# EAGLE design esquema (EAGLE 9.4.2)
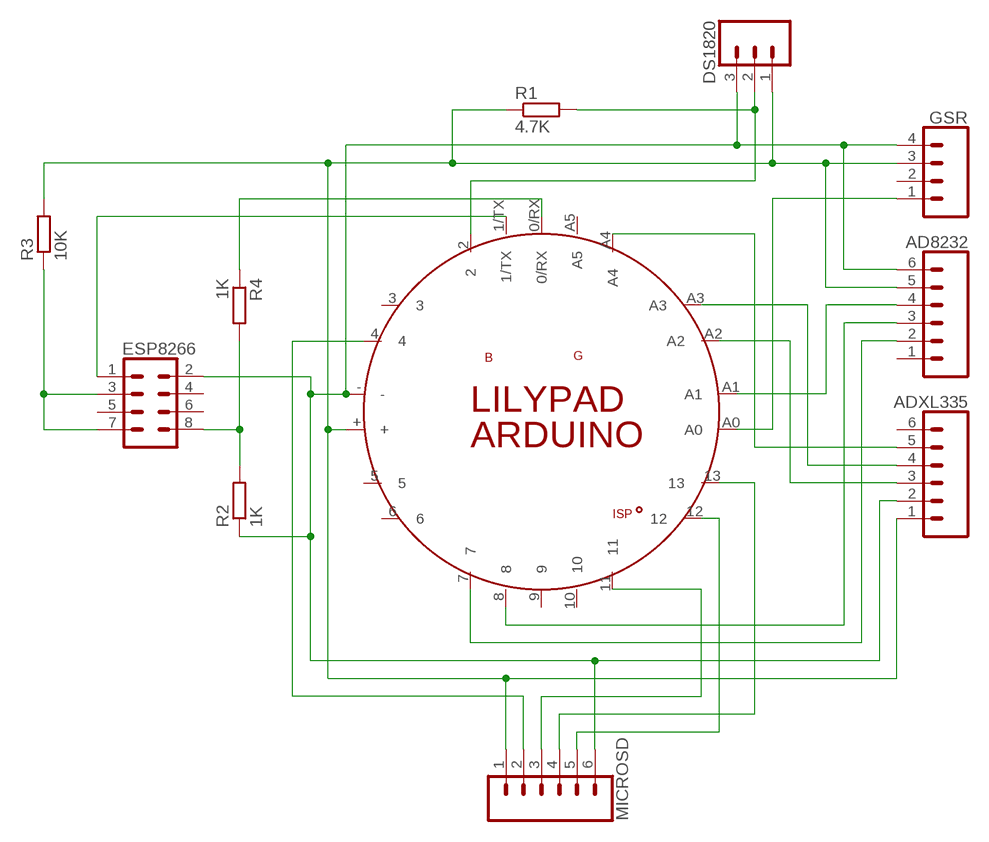
[diagram p0: schematic, sheet 1]

## Parts
AD8232  CONN_06FEMALE_LOCK  [1X06_FEMALE_LOCK.010]
ADXL335  CONN_06FEMALE_LOCK  [1X06_FEMALE_LOCK.010]
DS1820  CONN_03  [1X03]
ESP8266  CONN_04X2  [2X4]
GSR  CONN_04JST-PTH  [JST-4-PTH]
MICROSD  CONN_06FEMALE_LOCK  [1X06_FEMALE_LOCK.010]
PCB1  ARDUINO_LILYPAD  [ARDUINO_LILYPAD]
R1  4.7K  R-EU_0309/12  [0309/12]
R2  1K  R-EU_0309/12  [0309/12]
R3  10K  R-EU_0309/12  [0309/12]
R4  1K  R-EU_0309/12  [0309/12]

## Nets
N$1: MICROSD.3 PCB1.11
N$2: MICROSD.2 PCB1.4
N$3: GSR.1 PCB1.A0
N$4: AD8232.4 PCB1.A1
N$5: AD8232.3 PCB1.8
N$6: AD8232.2 PCB1.7
N$7: DS1820.2 PCB1.2 R1.2
N$8: ADXL335.3 PCB1.A2
N$9: ADXL335.4 PCB1.A3
N$10: ESP8266.3 ESP8266.7 R3.1
N$11: ADXL335.5 PCB1.A4
N$12: ESP8266.1 PCB1.1/TX
N$13: ESP8266.8 R2.2 R4.2
N$14: PCB1.0/RX R4.1
N$15: AD8232.5 ADXL335.1 DS1820.1 GSR.3 MICROSD.1 PCB1.+ R1.1 R3.2
N$16: AD8232.6 ADXL335.2 DS1820.3 ESP8266.2 GSR.4 MICROSD.6 PCB1.- R2.1
N$17: MICROSD.4 PCB1.13
N$18: MICROSD.5 PCB1.12
Unconnected: AD8232.1 ADXL335.6 ESP8266.4 ESP8266.5 ESP8266.6 GSR.2 PCB1.3 PCB1.5 PCB1.5V.(VCC) PCB1.6 PCB1.9 PCB1.10 PCB1.A5 PCB1.DTR PCB1.GND. PCB1.GND.. PCB1.GND_(GND) PCB1.MISO PCB1.MOSI PCB1.RESET..(RST) PCB1.RXI PCB1.SCK PCB1.TXO PCB1.VCC.

## Library data of the parts
AD8232 ADXL335 MICROSD = SparkFun-Connectors:CONN_06: Multi connection point. Often used as Generic Header-pin footprint for 0.1 inch spaced/style header connections On any of the 0.1 inch spaced packages, you can populate with these: Break Away Headers - Straight <https://www.sparkfun.com/products/116> (PRT-00116) Break Away Male Headers - Right Angle <https://www.sparkfun.com/products/553> (PRT-00553) Female Headers <https://www.sparkfun.com/products/115> (PRT-00115) Break Away Headers - Machine Pin <https://www.sparkfun.com/products/117> (PRT-00117) Break Away Female Headers - Swiss Machine Pin <https://www.sparkfun.com/products/743> (PRT-00743) Arduino Stackable Header - 6 Pin <https://www.sparkfun.com/products/9280> (PRT-09280) For SCREWTERMINALS and SPRING TERMINALS visit here: Screw Terimnals on SparkFun.com <https://www.sparkfun.com/search/results?term=Screw+Terminals> (5mm/3.5mm/2.54mm spacing) This device is also useful as a general connection point to wire up your design to another part of your project. Our various solder wires solder well into these plated through hole pads. Hook-Up Wire - Assortment (Stranded, 22 AWG) <https://www.sparkfun.com/products/11375> (PRT-11375) Hook-Up Wire - Assortment (Solid Core, 22 AWG) <https://www.sparkfun.com/products/11367> (PRT-11367) View the entire wire category on our website here <https://www.sparkfun.com/categories/141>
DS1820 = SparkFun-Connectors:CONN_03: Multi connection point. Often used as Generic Header-pin footprint for 0.1 inch spaced/style header connections On any of the 0.1 inch spaced packages, you can populate with these: Break Away Headers - Straight <https://www.sparkfun.com/products/116> (PRT-00116) Break Away Male Headers - Right Angle <https://www.sparkfun.com/products/553> (PRT-00553) Female Headers <https://www.sparkfun.com/products/115> (PRT-00115) Break Away Headers - Machine Pin <https://www.sparkfun.com/products/117> (PRT-00117) Break Away Female Headers - Swiss Machine Pin <https://www.sparkfun.com/products/743> (PRT-00743) Stackable Header - 3 Pin (Female, 0.1") <https://www.sparkfun.com/products/13875> (PRT-13875) For SCREWTERMINALS and SPRING TERMINALS visit here: Screw Terimnals on SparkFun.com <https://www.sparkfun.com/search/results?term=Screw+Terminals> (5mm/3.5mm/2.54mm spacing) This device is also useful as a general connection point to wire up your design to another part of your project. Our various solder wires solder well into these plated through hole pads. Hook-Up Wire - Assortment (Stranded, 22 AWG) <https://www.sparkfun.com/products/11375> (PRT-11375) Hook-Up Wire - Assortment (Solid Core, 22 AWG) <https://www.sparkfun.com/products/11367> (PRT-11367) View the entire wire category on our website here <https://www.sparkfun.com/categories/141> Special notes: Molex polarized connector foot print use with SKU : PRT-08232 with associated crimp pins and housings.; PROD_ID: XXX-00000; VALUE: 455-1750-1-ND
ESP8266 = SparkFun-Connectors:CONN_04X2: Multi connection point. Often used as Generic Header-pin footprint for 0.1 inch spaced/style header connections On any of the 0.1 inch spaced packages, you can populate with these: Break Away Headers - Straight <https://www.sparkfun.com/products/116> (PRT-00116) Break Away Male Headers - Right Angle <https://www.sparkfun.com/products/553> (PRT-00553) Female Headers <https://www.sparkfun.com/products/115> (PRT-00115) Break Away Headers - Machine Pin <https://www.sparkfun.com/products/117> (PRT-00117) Break Away Female Headers - Swiss Machine Pin <https://www.sparkfun.com/products/743> (PRT-00743)
GSR = SparkFun-Connectors:CONN_04: Multi connection point. Often used as Generic Header-pin footprint for 0.1 inch spaced/style header connections On any of the 0.1 inch spaced packages, you can populate with these: Break Away Headers - Straight <https://www.sparkfun.com/products/116> (PRT-00116) Break Away Male Headers - Right Angle <https://www.sparkfun.com/products/553> (PRT-00553) Female Headers <https://www.sparkfun.com/products/115> (PRT-00115) Break Away Headers - Machine Pin <https://www.sparkfun.com/products/117> (PRT-00117) Break Away Female Headers - Swiss Machine Pin <https://www.sparkfun.com/products/743> (PRT-00743) For SCREWTERMINALS and SPRING TERMINALS visit here: Screw Terimnals on SparkFun.com <https://www.sparkfun.com/search/results?term=Screw+Terminals> (5mm/3.5mm/2.54mm spacing) This device is also useful as a general connection point to wire up your design to another part of your project. Our various solder wires solder well into these plated through hole pads. Hook-Up Wire - Assortment (Stranded, 22 AWG) <https://www.sparkfun.com/products/11375> (PRT-11375) Hook-Up Wire - Assortment (Solid Core, 22 AWG) <https://www.sparkfun.com/products/11367> (PRT-11367) View the entire wire category on our website here <https://www.sparkfun.com/categories/141> Special notes: Molex polarized connector foot print use with SKU : PRT-08231 with associated crimp pins and housings. 1MM SMD Version SKU: PRT-10208; PROD_ID: WIRE-13531; SF_ID: PRT-09916
PCB1 = E14_Arduino_revB:ARDUINO_LILYPAD: Device for representing a Lilypad Arduino board with a footprint in an EAGLE design. Created by Dave Young for Element14. More EAGLE documentation at: http://www.element14.com/community/community/knode/cadsoft_eagle
R1-R4 = rcl:R-EU_: RESISTOR, European symbol; SPICEPREFIX: R

## Board
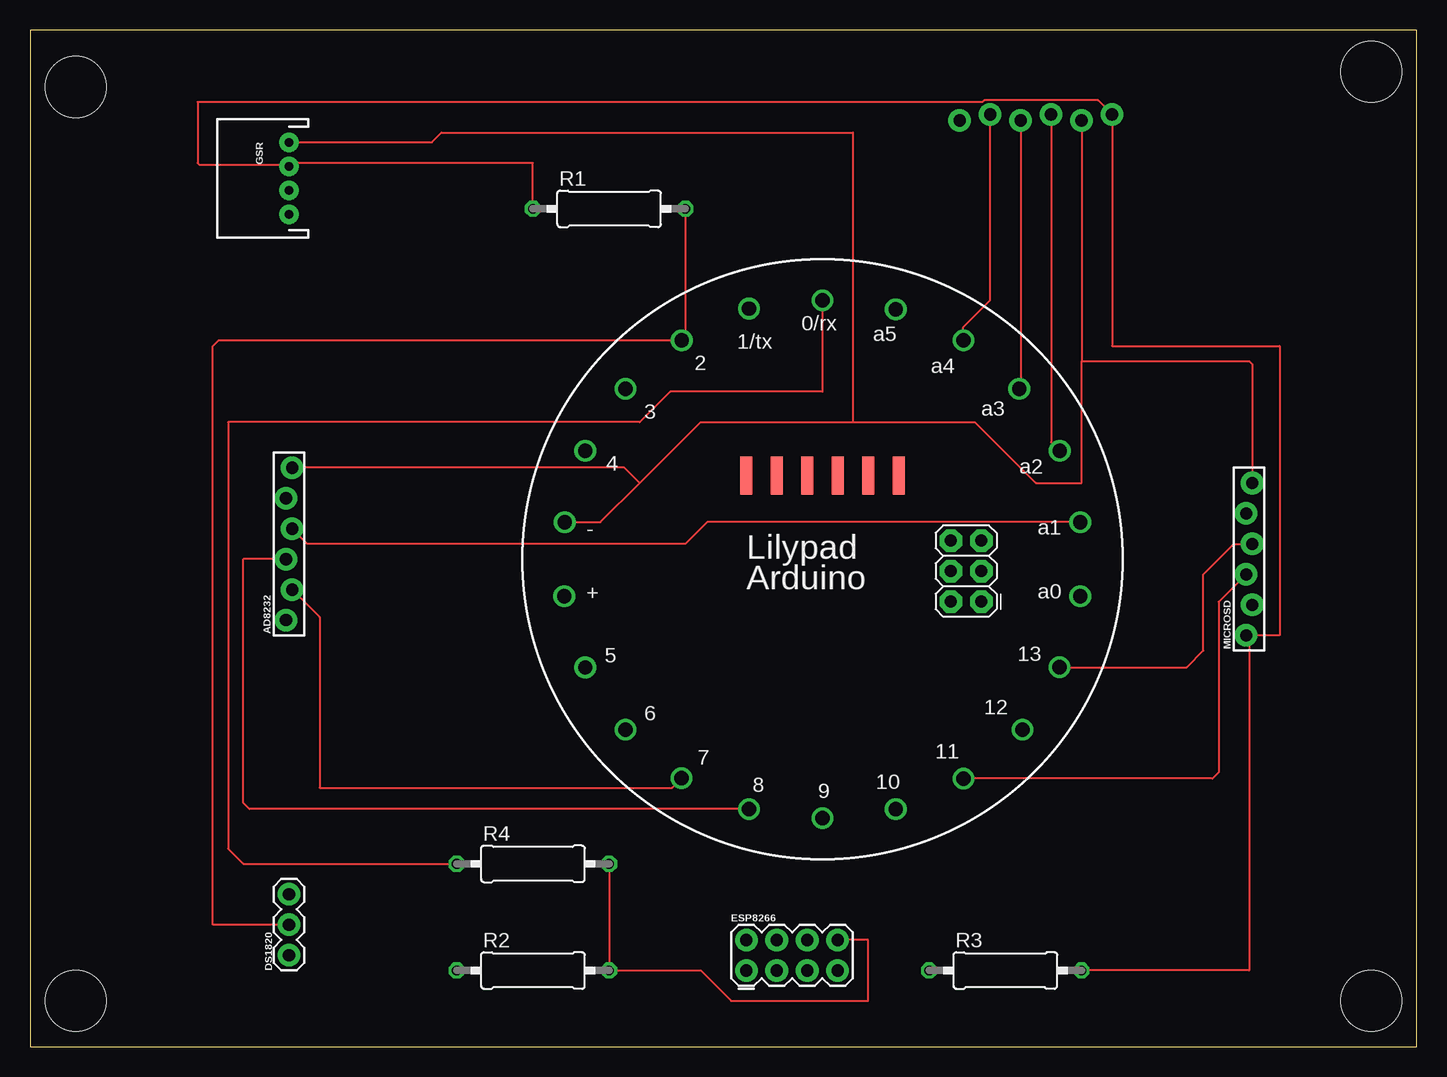
[diagram p1: board, top side]
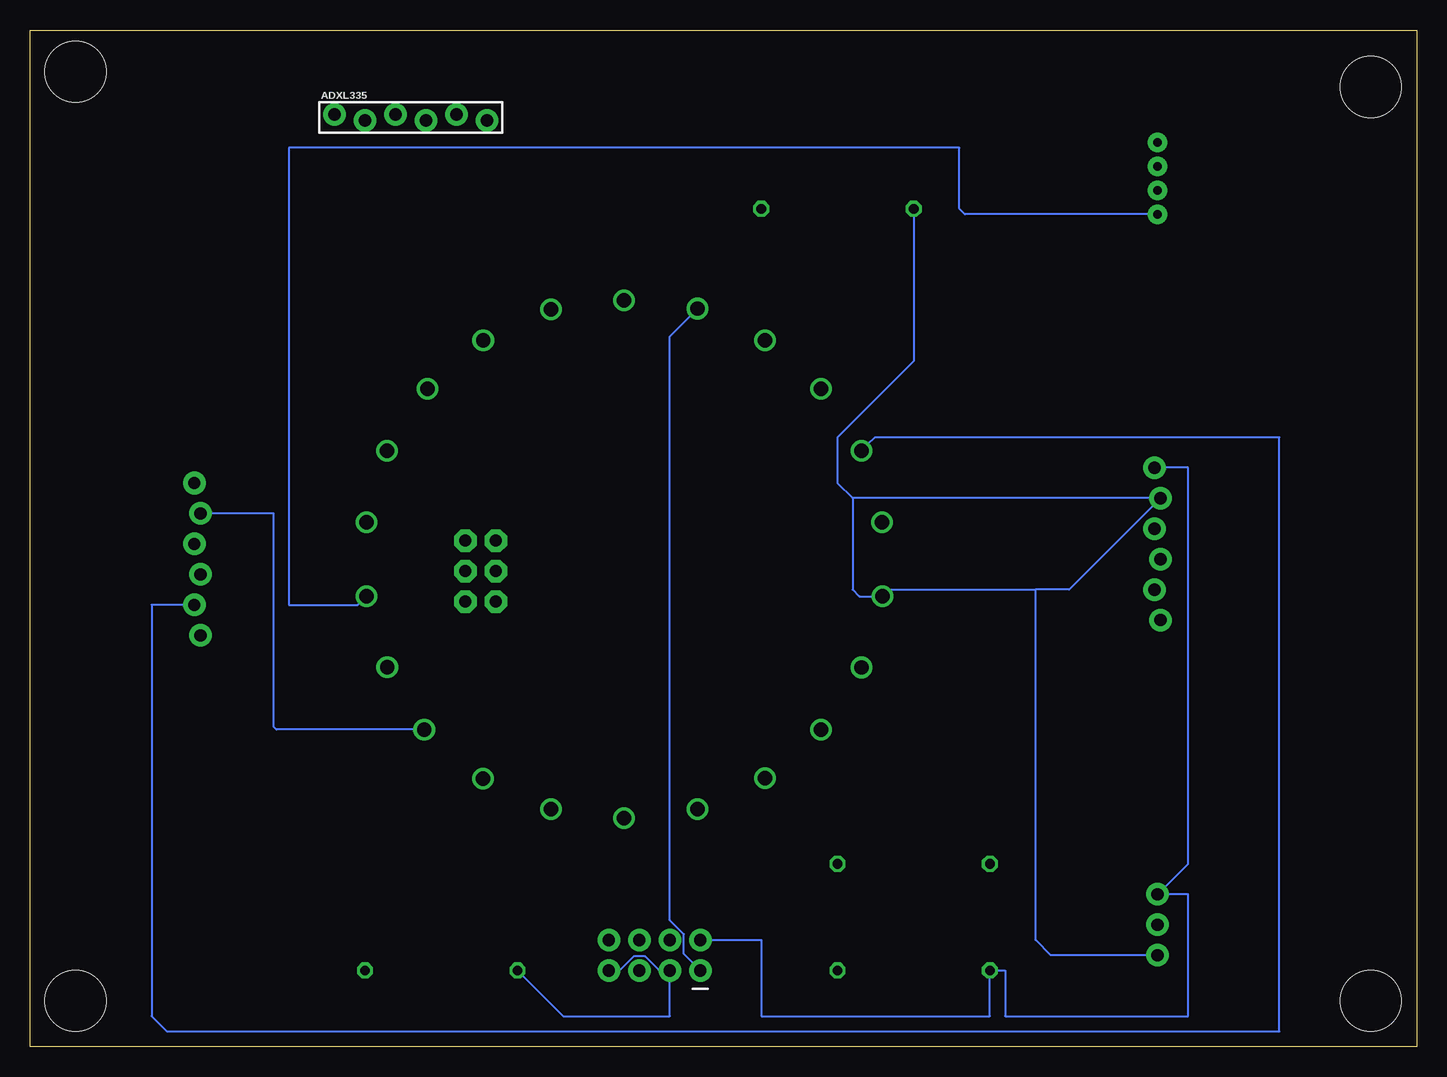
[diagram p2: board, bottom side, seen from below]

Size 115.55 x 84.76 mm. Coordinates in mm from the lower left corner, seen from the top.
Outline: 0,0 115.55,0 115.55,84.76 0,84.76 0,0
Copper layers (1*16): Top 0.035mm / dielectric 1.5mm / Bottom 0.035mm
Design rules "default": minimum track width 6mil, minimum drill 0.35mm, track to track 6mil, track to pad 6mil, pad to pad 6mil, via to via 6mil, smd to smd 6mil, copper to edge 40mil, drill to drill 6mil, minimum pad ring 10mil, minimum via ring 8mil, stop-mask expansion 4mil, vias tented up to drill 0mil, thermal gap 10mil
Holes 5.08 mm at 3.81,3.81 3.81,80.01 111.76,3.81 111.76,81.28

### Footprints (pad centres in the part's own frame; a part is rotated, then mirrored left to right if it is on the bottom)
1X06_FEMALE_LOCK.010 = drill 1.016 pad 1.88: 1 0,0.254; 2 2.54,-0.254; 3 5.08,0.254; 4 7.62,-0.254; 5 10.16,0.254; 6 12.7,-0.254
1X03 = drill 1.016 pad 1.88: 1 0,0; 2 2.54,0; 3 5.08,0
2X4 = drill 1.016 pad 1.88: 1 -3.81,-1.27; 2 -3.81,1.27; 3 -1.27,-1.27; 4 -1.27,1.27; 5 1.27,-1.27; 6 1.27,1.27; 7 3.81,-1.27; 8 3.81,1.27
JST-4-PTH = drill 0.7 pad 1.6: 1 -3,0; 2 -1,0; 3 1,0; 4 3,0
ARDUINO_LILYPAD = drill 1.2: 0/RX 0,21.59; 1/TX -6.13,20.89; 2 -11.73,18.26; 3 -16.4,14.21; 4 -19.77,9.03; 5 -19.77,-9.03; 6 -16.4,-14.21; 7 -11.74,-18.26; 8 -6.11,-20.83; 9 0,-21.59; 10 6.11,-20.83; 11 11.76,-18.28; 12 16.654,-14.21; 13 19.74,-9.02; + -21.52,-3.1; - -21.48,3.09; A0 21.48,-3.09; A1 21.48,3.09; A2 19.77,9.04; A3 16.4,14.21; A4 11.74,18.26; A5 6.11,20.83 | drill 1.016 pad 1.88 octagon: 5V. 10.693,-3.531; GND_ 10.693,1.549; MISO 13.233,-3.531; MOSI 10.693,-0.991; RESET.. 13.233,1.549; SCK 13.233,-0.991 | smd 1.016 x 3.175: DTR 6.35,6.985; GND. -6.35,6.985; GND.. -3.81,6.985; RXI 1.27,6.985; TXO 3.81,6.985; VCC. -1.27,6.985
0309/12 = drill 0.813 octagon: 1 -6.35,0; 2 6.35,0

### Placement (x,y rotation side)
AD8232  21.59,35.56 90 top
ADXL335  90.17,77.47 0 bottom
DS1820  21.59,7.62 90 top
ESP8266  63.5,7.62 0 top
GSR  21.59,72.39 90 top
MICROSD  101.6,34.29 90 top
PCB1  66.04,40.64 0 top
R1  48.26,69.85 0 top
R2  41.91,6.35 0 top
R3  81.28,6.35 0 top
R4  41.91,15.24 0 top

### Tracks (layer width: path | path; a pad name or v marks a point on that pad's centre or on a via)
N$1
  Top 0.152: MICROSD.3 99.06,37.08 99.06,22.86 98.56,22.36 PCB1.11
N$2
  Bottom 0.152: PCB1.4 46.07,49.88 45.72,50.22 45.14,50.8 11.43,50.8 11.43,1.27 104.14,1.27 105.41,2.54 105.41,36.83 MICROSD.2
N$3
  Bottom 0.152: GSR.1 37.64,69.39 38.1,69.85 38.1,74.93 93.98,74.93 93.98,36.83 88.24,36.83 PCB1.A0
N$4
  Top 0.152: PCB1.A1 56.43,43.73 54.61,41.91 23.11,41.91 AD8232.4
N$5
  Top 0.152: AD8232.3 17.78,40.64 17.78,20.32 18.29,19.81 PCB1.8
N$6
  Top 0.152: AD8232.2 24.13,35.81 24.13,21.59 53.51,21.59 PCB1.7
N$7
  Top 0.152: R1.2 54.61,59.2 PCB1.2 15.72,58.9 15.24,58.42 15.24,10.16 DS1820.2
N$8
  Top 0.152: ADXL335.3 85.09,50.4 PCB1.A2
N$9
  Top 0.152: ADXL335.4 82.55,54.96 PCB1.A3
N$10
  Bottom 0.152: R3.1 71.12,2.54 62.23,2.54 ESP8266.3 63.12,6.35 64.29,7.52 65.25,7.52 66.42,6.35 ESP8266.7
N$11
  Top 0.152: PCB1.A4 77.78,60 80.01,62.23 ADXL335.5
N$12
  Bottom 0.152: ESP8266.1 61.06,7.72 61.06,9.37 62.23,10.54 62.23,59.21 PCB1.1/TX
N$13
  Top 0.152: R4.2 R2.2 55.88,6.35 58.42,3.81 69.85,3.81 69.85,8.89 ESP8266.8
N$14
  Top 0.152: PCB1.0/RX 66.04,54.61 53.34,54.61 50.8,52.07 16.51,52.07 16.51,16.51 17.78,15.24 R4.1
N$15
  Top 0.152: R1.1 41.91,73.66 21.86,73.66 21.72,73.52 | 21.72,73.52 GSR.3 | 21.72,73.52 14.11,73.52 13.97,73.66 13.97,78.74 79.37,78.74 79.53,78.89 89,78.89 ADXL335.1 90.17,58.42 104.14,58.42 104.14,34.29 MICROSD.1 101.6,34.04 101.6,6.35 R3.2
  Bottom 0.152: DS1820.1 30.48,7.62 31.75,8.89 31.75,38.1 | 44.45,38.1 31.75,38.1 | 31.75,38.1 28.96,38.1 AD8232.5 46.99,45.72 | 46.99,45.72 46.99,38.1 46.43,37.54 PCB1.+ | R1.1 41.91,57.15 48.26,50.8 48.26,46.99 46.99,45.72
N$16
  Top 0.152: ADXL335.2 87.63,57.15 | 87.63,57.15 101.6,57.15 101.85,56.9 MICROSD.6 | PCB1.- 47.54,43.73 50.8,46.99 | AD8232.6 49.53,48.26 50.8,46.99 | 50.8,46.99 55.88,52.07 68.58,52.07 | 87.63,57.15 87.63,46.99 83.82,46.99 78.74,52.07 68.58,52.07 | GSR.4 33.48,75.39 34.29,76.2 68.58,76.2 68.58,52.07
  Bottom 0.152: ESP8266.2 54.61,8.89 54.61,2.54 35.56,2.54 R2.1 34.29,6.35 34.29,2.54 19.05,2.54 19.05,12.7 DS1820.3 19.05,15.24 19.05,48.26 AD8232.6
N$17
  Top 0.152: PCB1.13 96.39,31.62 97.79,33.02 97.79,39.37 100.33,41.91 MICROSD.4
N$18
  Bottom 0.152: PCB1.12 95.01,26.43 95.25,26.67 95.25,44.45 MICROSD.5